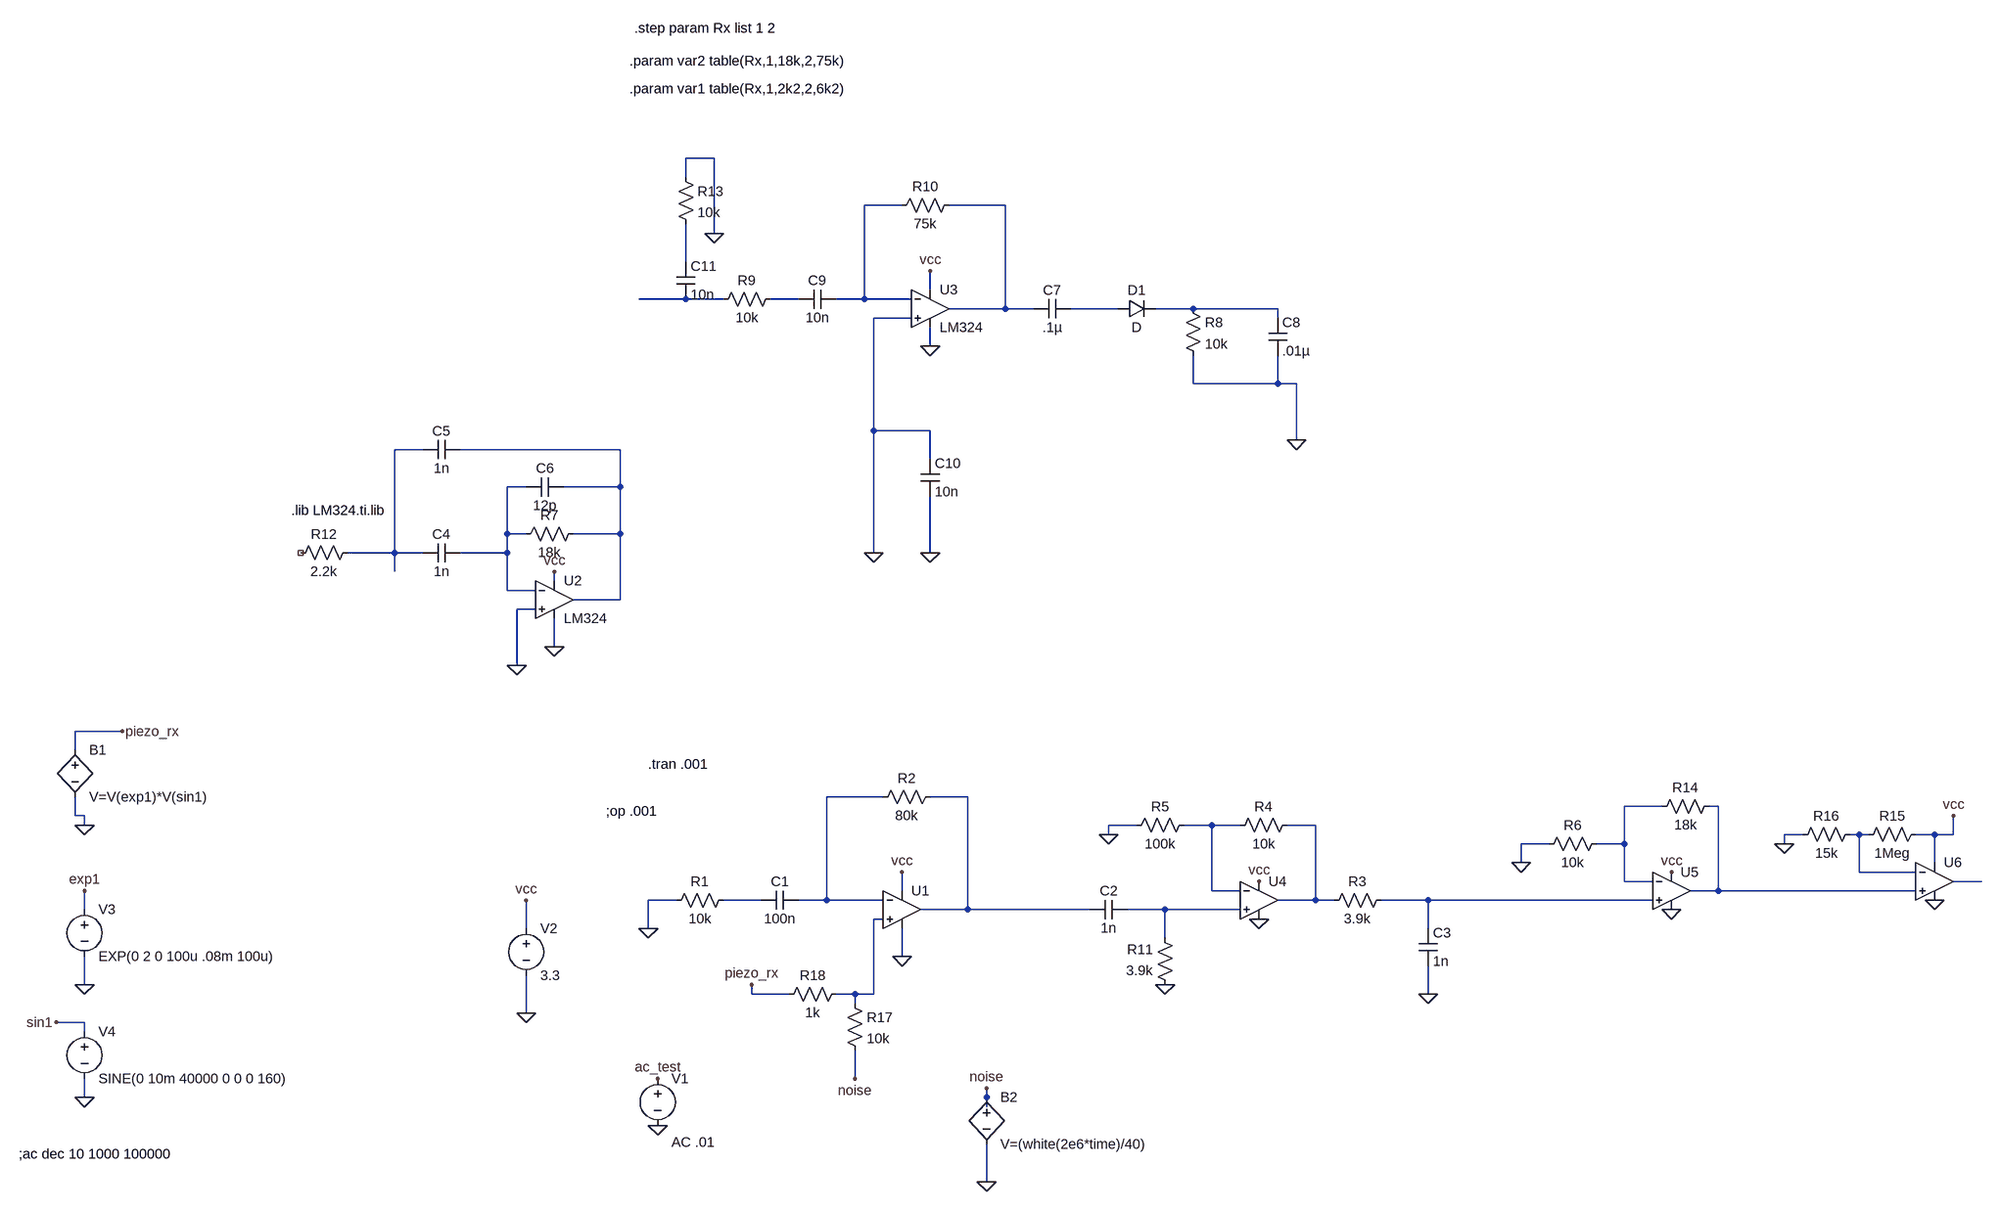
[diagram p0: schematic coLAS_analog.asc]
coLAS_analog.asc, the LTspice schematic file:
Version 4
SHEET 1 3408 680
WIRE -80 -1168 -128 -1168
WIRE -128 -1136 -128 -1168
WIRE 240 -1088 176 -1088
WIRE 416 -1088 320 -1088
WIRE -80 -1040 -80 -1168
WIRE -128 -992 -128 -1056
WIRE 288 -944 288 -976
WIRE -128 -928 -208 -928
WIRE -64 -928 -128 -928
WIRE 64 -928 16 -928
WIRE 176 -928 176 -1088
WIRE 176 -928 128 -928
WIRE 256 -928 176 -928
WIRE 416 -912 416 -1088
WIRE 416 -912 320 -912
WIRE 464 -912 416 -912
WIRE 608 -912 528 -912
WIRE 736 -912 672 -912
WIRE 880 -912 736 -912
WIRE 256 -896 192 -896
WIRE 880 -896 880 -912
WIRE 288 -848 288 -880
WIRE 736 -784 736 -832
WIRE 880 -784 880 -832
WIRE 880 -784 736 -784
WIRE 912 -784 880 -784
WIRE 192 -704 192 -896
WIRE 288 -704 192 -704
WIRE 912 -688 912 -784
WIRE -576 -672 -624 -672
WIRE -240 -672 -512 -672
WIRE 288 -656 288 -704
WIRE -400 -608 -432 -608
WIRE -240 -608 -240 -672
WIRE -240 -608 -336 -608
WIRE -432 -528 -432 -608
WIRE -400 -528 -432 -528
WIRE -240 -528 -240 -608
WIRE -240 -528 -320 -528
WIRE -624 -496 -624 -672
WIRE -624 -496 -704 -496
WIRE -576 -496 -624 -496
WIRE -432 -496 -432 -528
WIRE -432 -496 -512 -496
WIRE 192 -496 192 -704
WIRE 288 -496 288 -592
WIRE -624 -464 -624 -496
WIRE -352 -448 -352 -464
WIRE -432 -432 -432 -496
WIRE -384 -432 -432 -432
WIRE -240 -416 -240 -528
WIRE -240 -416 -320 -416
WIRE -384 -400 -416 -400
WIRE -352 -336 -352 -384
WIRE -416 -304 -416 -400
WIRE -1088 -192 -1168 -192
WIRE -1168 -160 -1168 -192
WIRE 208 -80 112 -80
WIRE 352 -80 288 -80
WIRE 1536 -64 1472 -64
WIRE 1632 -64 1616 -64
WIRE -1168 -48 -1168 -80
WIRE -1152 -48 -1168 -48
WIRE -1152 -32 -1152 -48
WIRE 640 -32 592 -32
WIRE 768 -32 720 -32
WIRE 816 -32 768 -32
WIRE 944 -32 896 -32
WIRE 592 -16 592 -32
WIRE 1776 -16 1744 -16
WIRE 1872 -16 1856 -16
WIRE 1888 -16 1872 -16
WIRE 2000 -16 1968 -16
WIRE 2032 -16 2032 -48
WIRE 2032 -16 2000 -16
WIRE 1344 0 1296 0
WIRE 1472 0 1472 -64
WIRE 1472 0 1424 0
WIRE 1744 0 1744 -16
WIRE 1296 32 1296 0
WIRE 2000 32 2000 -16
WIRE 1872 48 1872 -16
WIRE 1968 48 1872 48
WIRE 1472 64 1472 0
WIRE 1520 64 1472 64
WIRE 2080 64 2032 64
WIRE 240 80 240 48
WIRE 768 80 768 -32
WIRE 816 80 768 80
WIRE 1632 80 1632 -64
WIRE 1632 80 1584 80
WIRE 1968 80 1632 80
WIRE -144 96 -192 96
WIRE 0 96 -64 96
WIRE 112 96 112 -80
WIRE 112 96 64 96
WIRE 208 96 112 96
WIRE 944 96 944 -32
WIRE 944 96 880 96
WIRE 976 96 944 96
WIRE 1136 96 1056 96
WIRE 1520 96 1136 96
WIRE -1152 112 -1152 80
WIRE 352 112 352 -80
WIRE 352 112 272 112
WIRE 560 112 352 112
WIRE 688 112 624 112
WIRE 816 112 688 112
WIRE 208 128 192 128
WIRE -400 144 -400 96
WIRE -192 144 -192 96
WIRE 1136 144 1136 96
WIRE 688 160 688 112
WIRE 240 192 240 144
WIRE -1152 240 -1152 192
WIRE -16 256 -16 240
WIRE 48 256 -16 256
WIRE 160 256 128 256
WIRE 192 256 192 128
WIRE 192 256 160 256
WIRE 1136 256 1136 208
WIRE 160 272 160 256
WIRE -400 288 -400 224
WIRE -1152 304 -1200 304
WIRE -1152 320 -1152 304
WIRE 160 400 160 352
WIRE -1152 432 -1152 400
WIRE 384 432 384 416
WIRE 384 448 384 432
WIRE 384 576 384 512
FLAG -400 96 vcc
FLAG -400 288 0
FLAG 240 48 vcc
FLAG 240 192 0
FLAG -352 -464 vcc
FLAG -352 -336 0
FLAG 912 -688 0
FLAG -1152 240 0
FLAG -1152 80 exp1
FLAG -1200 304 sin1
FLAG -1088 -192 piezo_rx
FLAG -1152 -32 0
FLAG -1152 432 0
FLAG 192 -496 0
FLAG 288 -496 0
FLAG 288 -976 vcc
FLAG 288 -848 0
FLAG -80 -1040 0
FLAG -192 144 0
FLAG 688 240 0
FLAG 592 -16 0
FLAG 848 64 vcc
FLAG 848 128 0
FLAG 1136 256 0
FLAG -176 480 0
FLAG -176 400 ac_test
FLAG -416 -304 0
FLAG 1296 32 0
FLAG 1552 48 vcc
FLAG 1552 112 0
FLAG 2032 -48 vcc
FLAG 1744 0 0
FLAG 2000 96 0
FLAG 384 576 0
FLAG 384 416 noise
FLAG 160 400 noise
FLAG -16 240 piezo_rx
SYMBOL voltage -400 128 R0
WINDOW 123 0 0 Left 0
WINDOW 39 0 0 Left 0
SYMATTR InstName V2
SYMATTR Value 3.3
SYMBOL res -48 80 R90
WINDOW 0 0 56 VBottom 2
WINDOW 3 32 56 VTop 2
SYMATTR InstName R1
SYMATTR Value 10k
SYMBOL cap -512 -512 R90
WINDOW 0 0 32 VBottom 2
WINDOW 3 32 32 VTop 2
SYMATTR InstName C4
SYMATTR Value 1n
SYMBOL cap -512 -688 R90
WINDOW 0 0 32 VBottom 2
WINDOW 3 32 32 VTop 2
SYMATTR InstName C5
SYMATTR Value 1n
SYMBOL cap -336 -624 R90
WINDOW 0 0 32 VBottom 2
WINDOW 3 32 32 VTop 2
SYMATTR InstName C6
SYMATTR Value 12p
SYMBOL res -304 -544 R90
WINDOW 0 0 56 VBottom 2
WINDOW 3 32 56 VTop 2
SYMATTR InstName R7
SYMATTR Value 18k
SYMBOL Opamps\\opamp2 -352 -480 R0
SYMATTR InstName U2
SYMATTR Value LM324
SYMBOL voltage -1152 96 R0
WINDOW 123 0 0 Left 0
WINDOW 39 0 0 Left 0
SYMATTR InstName V3
SYMATTR Value EXP(0 2 0 100u .08m 100u)
SYMBOL voltage -1152 304 R0
WINDOW 123 0 0 Left 0
WINDOW 39 0 0 Left 0
SYMATTR InstName V4
SYMATTR Value SINE(0 10m 40000 0 0 0 160)
SYMBOL bv -1168 -176 R0
SYMATTR InstName B1
SYMATTR Value V=V(exp1)*V(sin1)
SYMBOL res 32 -944 R90
WINDOW 0 0 56 VBottom 2
WINDOW 3 32 56 VTop 2
SYMATTR InstName R9
SYMATTR Value 10k
SYMBOL cap 128 -944 R90
WINDOW 0 0 32 VBottom 2
WINDOW 3 32 32 VTop 2
SYMATTR InstName C9
SYMATTR Value 10n
SYMBOL Opamps\\opamp2 288 -976 R0
SYMATTR InstName U3
SYMATTR Value LM324
SYMBOL res 336 -1104 R90
WINDOW 0 0 56 VBottom 2
WINDOW 3 32 56 VTop 2
SYMATTR InstName R10
SYMATTR Value 75k
SYMBOL cap 272 -656 R0
SYMATTR InstName C10
SYMATTR Value 10n
SYMBOL cap -144 -992 R0
SYMATTR InstName C11
SYMATTR Value 10n
SYMBOL res -144 -1152 R0
SYMATTR InstName R13
SYMATTR Value 10k
SYMBOL diode 608 -896 R270
WINDOW 0 32 32 VTop 2
WINDOW 3 0 32 VBottom 2
SYMATTR InstName D1
SYMBOL res 720 -928 R0
SYMATTR InstName R8
SYMATTR Value 10k
SYMBOL cap 528 -928 R90
WINDOW 0 0 32 VBottom 2
WINDOW 3 32 32 VTop 2
SYMATTR InstName C7
SYMATTR Value .1µ
SYMBOL cap 864 -896 R0
SYMATTR InstName C8
SYMATTR Value .01µ
SYMBOL Opamps\\UniversalOpamp2 240 112 R0
SYMATTR InstName U1
SYMATTR Value2 Avol=1Meg GBW=3Meg Slew=2.4Meg
SYMATTR SpiceLine ilimit=7m rail=0 Vos=2m phimargin=45
SYMBOL res 304 -96 R90
WINDOW 0 0 56 VBottom 2
WINDOW 3 32 56 VTop 2
SYMATTR InstName R2
SYMATTR Value 80k
SYMBOL cap 64 80 R90
WINDOW 0 0 32 VBottom 2
WINDOW 3 32 32 VTop 2
SYMATTR InstName C1
SYMATTR Value 100n
SYMBOL Opamps\\UniversalOpamp2 848 96 R0
SYMATTR InstName U4
SYMATTR Value2 Avol=1Meg GBW=3Meg Slew=2.4Meg
SYMATTR SpiceLine ilimit=7m rail=0 Vos=2m phimargin=45
SYMBOL res 1072 80 R90
WINDOW 0 0 56 VBottom 2
WINDOW 3 32 56 VTop 2
SYMATTR InstName R3
SYMATTR Value 3.9k
SYMBOL res 912 -48 R90
WINDOW 0 0 56 VBottom 2
WINDOW 3 32 56 VTop 2
SYMATTR InstName R4
SYMATTR Value 10k
SYMBOL res 624 -16 R270
WINDOW 0 32 56 VTop 2
WINDOW 3 0 56 VBottom 2
SYMATTR InstName R5
SYMATTR Value 100k
SYMBOL res 704 256 R180
WINDOW 0 36 76 Left 2
WINDOW 3 36 40 Left 2
SYMATTR InstName R11
SYMATTR Value 3.9k
SYMBOL cap 1120 144 R0
SYMATTR InstName C3
SYMATTR Value 1n
SYMBOL voltage -176 384 R0
WINDOW 123 24 124 Left 2
WINDOW 39 0 0 Left 0
SYMATTR Value2 AC .01
SYMATTR InstName V1
SYMATTR Value ""
SYMBOL res -688 -512 R90
WINDOW 0 0 56 VBottom 2
WINDOW 3 32 56 VTop 2
SYMATTR InstName R12
SYMATTR Value 2.2k
SYMBOL cap 624 96 R90
WINDOW 0 0 32 VBottom 2
WINDOW 3 32 32 VTop 2
SYMATTR InstName C2
SYMATTR Value 1n
SYMBOL Opamps\\UniversalOpamp2 1552 80 R0
SYMATTR InstName U5
SYMATTR Value2 Avol=1Meg GBW=3Meg Slew=2.4Meg
SYMATTR SpiceLine ilimit=7m rail=0 Vos=2m phimargin=45
SYMBOL res 1440 -16 R90
WINDOW 0 0 56 VBottom 2
WINDOW 3 32 56 VTop 2
SYMATTR InstName R6
SYMATTR Value 10k
SYMBOL res 1632 -80 R90
WINDOW 0 0 56 VBottom 2
WINDOW 3 32 56 VTop 2
SYMATTR InstName R14
SYMATTR Value 18k
SYMBOL Opamps\\UniversalOpamp2 2000 64 R0
SYMATTR InstName U6
SYMATTR Value2 Avol=1Meg GBW=3Meg Slew=2.4Meg
SYMATTR SpiceLine ilimit=7m rail=0 Vos=2m phimargin=45
SYMBOL res 1984 -32 R90
WINDOW 0 0 56 VBottom 2
WINDOW 3 32 56 VTop 2
SYMATTR InstName R15
SYMATTR Value 1Meg
SYMBOL res 1872 -32 R90
WINDOW 0 0 56 VBottom 2
WINDOW 3 32 56 VTop 2
SYMATTR InstName R16
SYMATTR Value 15k
SYMBOL bv 384 416 R0
SYMATTR InstName B2
SYMATTR Value V=(white(2e6*time)/40)
SYMBOL res 144 256 R0
SYMATTR InstName R17
SYMATTR Value 10k
SYMBOL res 144 240 R90
WINDOW 0 0 56 VBottom 2
WINDOW 3 32 56 VTop 2
SYMATTR InstName R18
SYMATTR Value 1k
TEXT -800 -568 Left 2 !.lib LM324.ti.lib
TEXT -192 -136 Left 2 !.tran .001
TEXT -216 -1432 Left 2 !.step param Rx list 1 2
TEXT -224 -1376 Left 2 !.param var2 table(Rx,1,18k,2,75k)
TEXT -224 -1328 Left 2 !.param var1 table(Rx,1,2k2,2,6k2)
TEXT -1264 528 Left 2 !;ac dec 10 1000 100000
TEXT -264 -56 Left 2 !;op .001

The netlist it stands for:
* coLAS_analog.asc
V2 vcc 0 3.3
R1 N019 0 10k
C4 N010 N008 1n
C5 N009 N008 1n
C6 N009 N010 12p
R7 N009 N010 18k
XU2 0 N010 vcc 0 N009 LM324  ; pins In+ In- V+ V- OUT
V3 exp1 0 EXP(0 2 0 100u .08m 100u)
V4 sin1 0 SINE(0 10m 40000 0 0 0 160)
B1 piezo_rx 0 V=V(exp1)*V(sin1)
R9 N005 N004 10k
C9 N001 N005 10n
XU3 0 N001 vcc 0 N002 LM324  ; pins In+ In- V+ V- OUT
R10 N002 N001 75k
C10 0 0 10n
C11 N003 N004 10n
R13 0 N003 10k
D1 N006 N007 D
R8 N007 0 10k
C7 N006 N002 .1µ
C8 N007 0 .01µ
XU1 N022 N011 vcc 0 N012 level.2 Avol=1Meg GBW=3Meg Slew=2.4Meg ilimit=7m rail=0 Vos=2m phimargin=45 en=0 enk=0 in=0 ink=0 Rin=500Meg  ; pins IN+ IN- V+ V- OUT
R2 N012 N011 80k
C1 N011 N019 100n
XU4 N021 N015 vcc 0 N016 level.2 Avol=1Meg GBW=3Meg Slew=2.4Meg ilimit=7m rail=0 Vos=2m phimargin=45 en=0 enk=0 in=0 ink=0 Rin=500Meg  ; pins IN+ IN- V+ V- OUT
R3 N020 N016 3.9k
R4 N016 N015 10k
R5 0 N015 100k
R11 0 N021 3.9k
C3 N020 0 1n
V1 ac_test 0 AC .01
R12 N008 NC_01 2.2k
C2 N021 N012 1n
XU5 N020 N013 vcc 0 N014 level.2 Avol=1Meg GBW=3Meg Slew=2.4Meg ilimit=7m rail=0 Vos=2m phimargin=45 en=0 enk=0 in=0 ink=0 Rin=500Meg  ; pins IN+ IN- V+ V- OUT
R6 N013 0 10k
R14 N014 N013 18k
XU6 N014 N017 vcc 0 N018 level.2 Avol=1Meg GBW=3Meg Slew=2.4Meg ilimit=7m rail=0 Vos=2m phimargin=45 en=0 enk=0 in=0 ink=0 Rin=500Meg  ; pins IN+ IN- V+ V- OUT
R15 vcc N017 1Meg
R16 N017 0 15k
B2 noise 0 V=(white(2e6*time)/40)
R17 N022 noise 10k
R18 N022 piezo_rx 1k
.model D D
.lib standard.dio
.lib LM324.ti.lib
.tran .001
.step param Rx list 1 2
.param var2 table(Rx,1,18k,2,75k)
.param var1 table(Rx,1,2k2,2,6k2)
;ac dec 10 1000 100000
;op .001
.lib UniversalOpamps2.sub
.backanno
.end